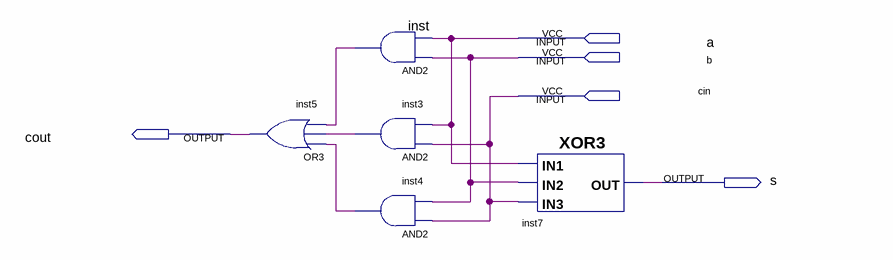
[diagram p0: schematic sheet]
// Quartus schematic FullAdder.bdf as structural Verilog: 5 symbols, 5 pins
module FullAdder (
  input  a,
  input  b,
  input  cin,
  output cout,
  output s
);

  wire inst3_out, inst4_out, inst_out;

  or inst5 (cout, inst4_out, inst3_out, inst_out);
  and inst (inst_out, b, a);
  and inst3 (inst3_out, cin, a);
  and inst4 (inst4_out, cin, b);
  XOR3 inst7 (.IN3(cin), .IN1(a), .IN2(b), .OUT(s));
endmodule
